# Altium project OpenRex_V1I1.PrjPcb (part 10 of 13)

## Sheet [22] - SD CARD, SPI, FLASH, EEPROM,.SchDoc
size A2; DocumentNumber: 22; SheetNumber: 22; SheetTotal: 31
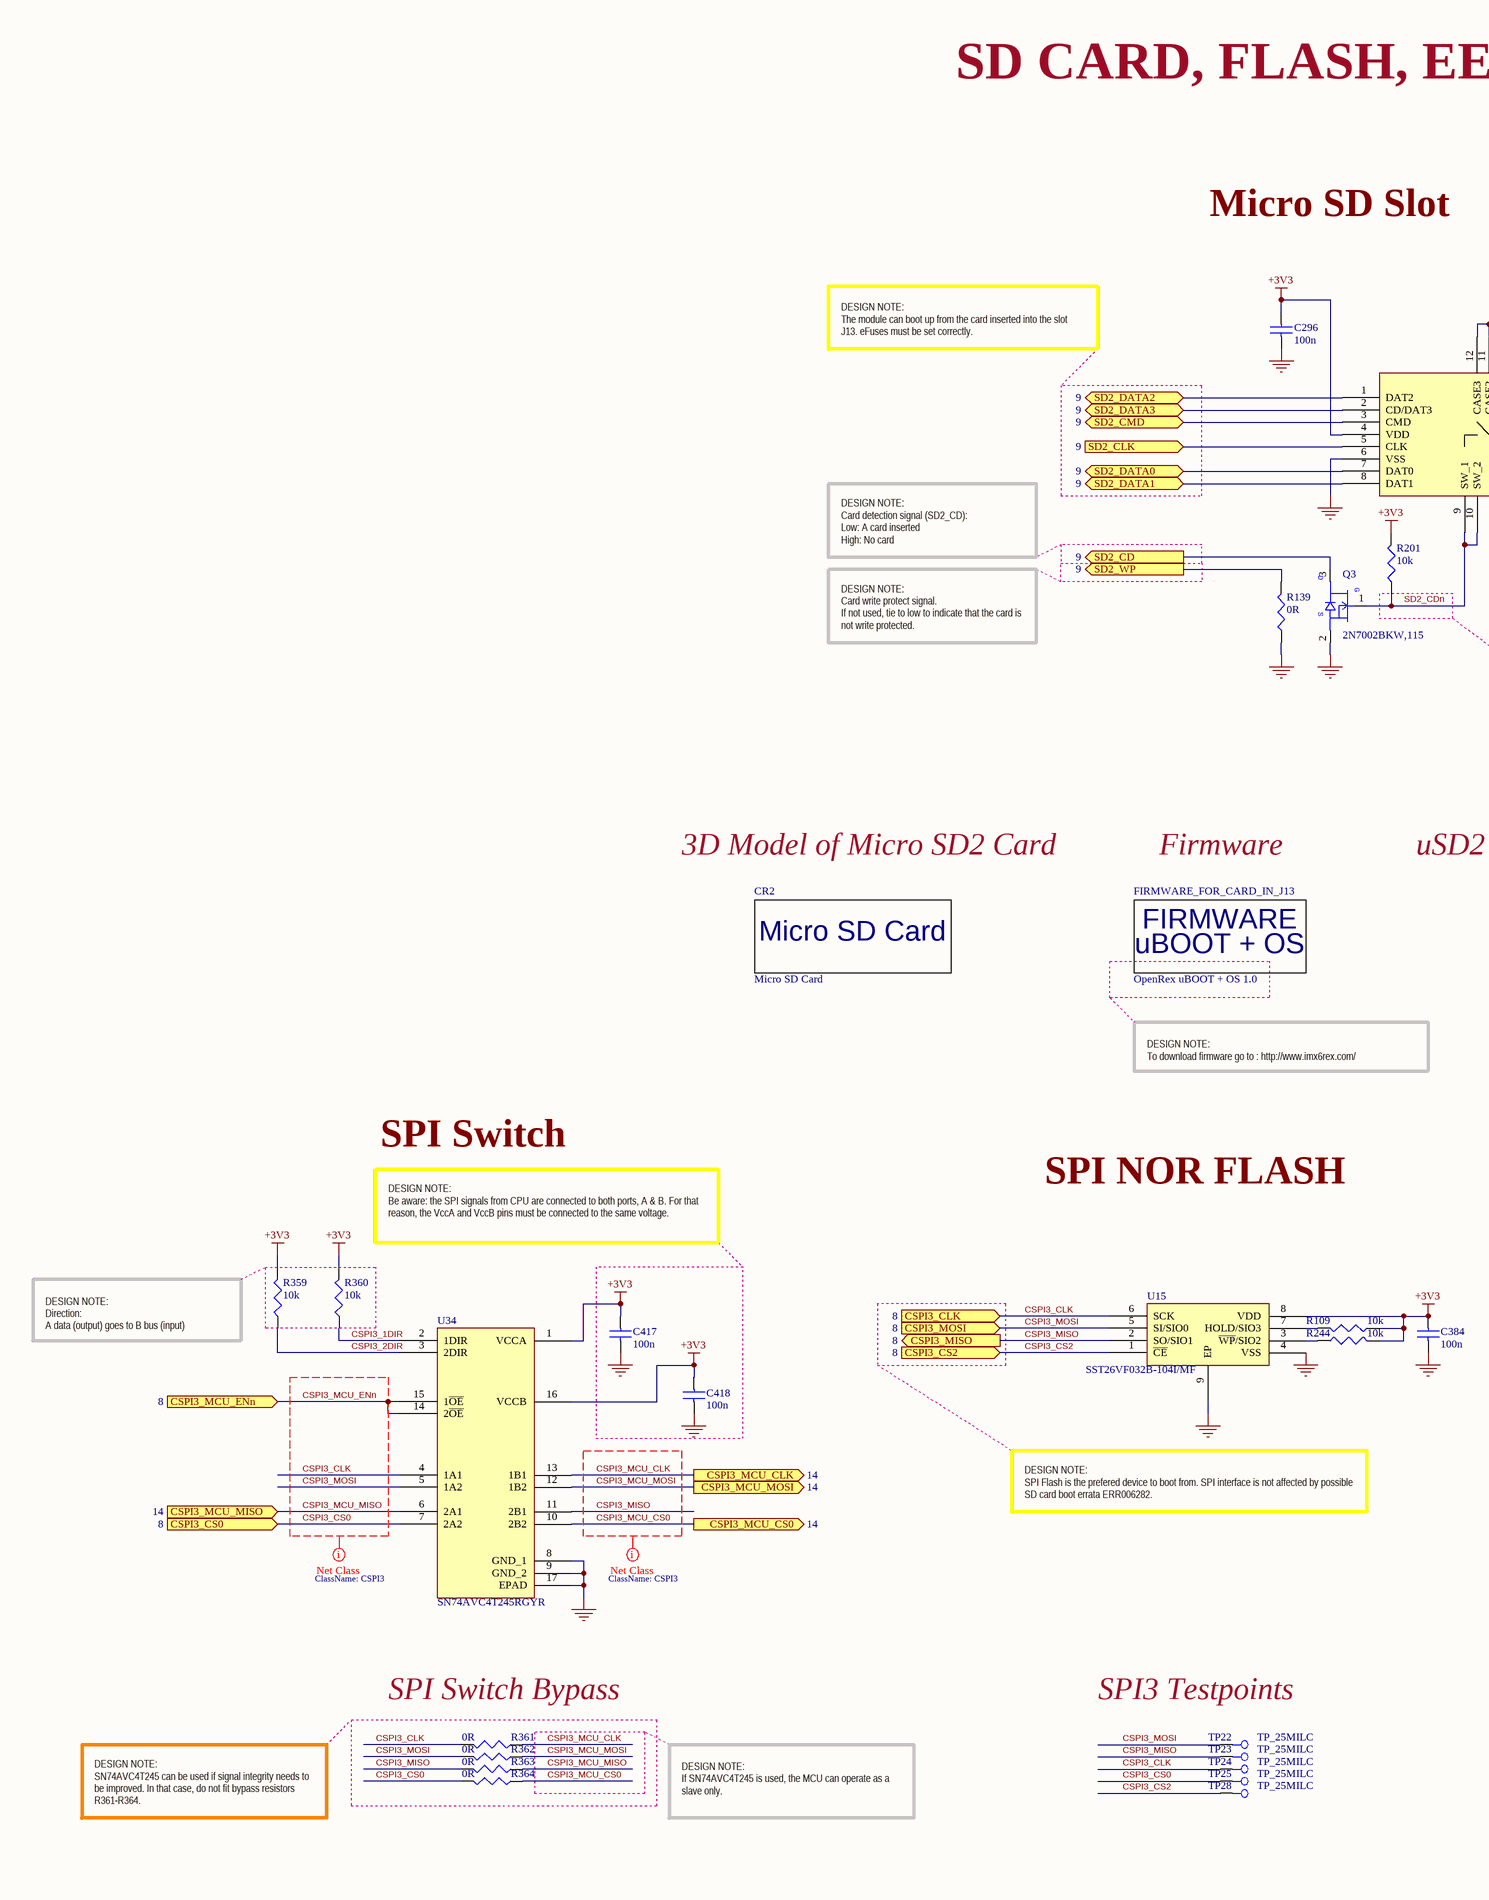
[diagram p40: [22] - SD CARD, SPI, FLASH, EEPROM,.SchDoc, left]
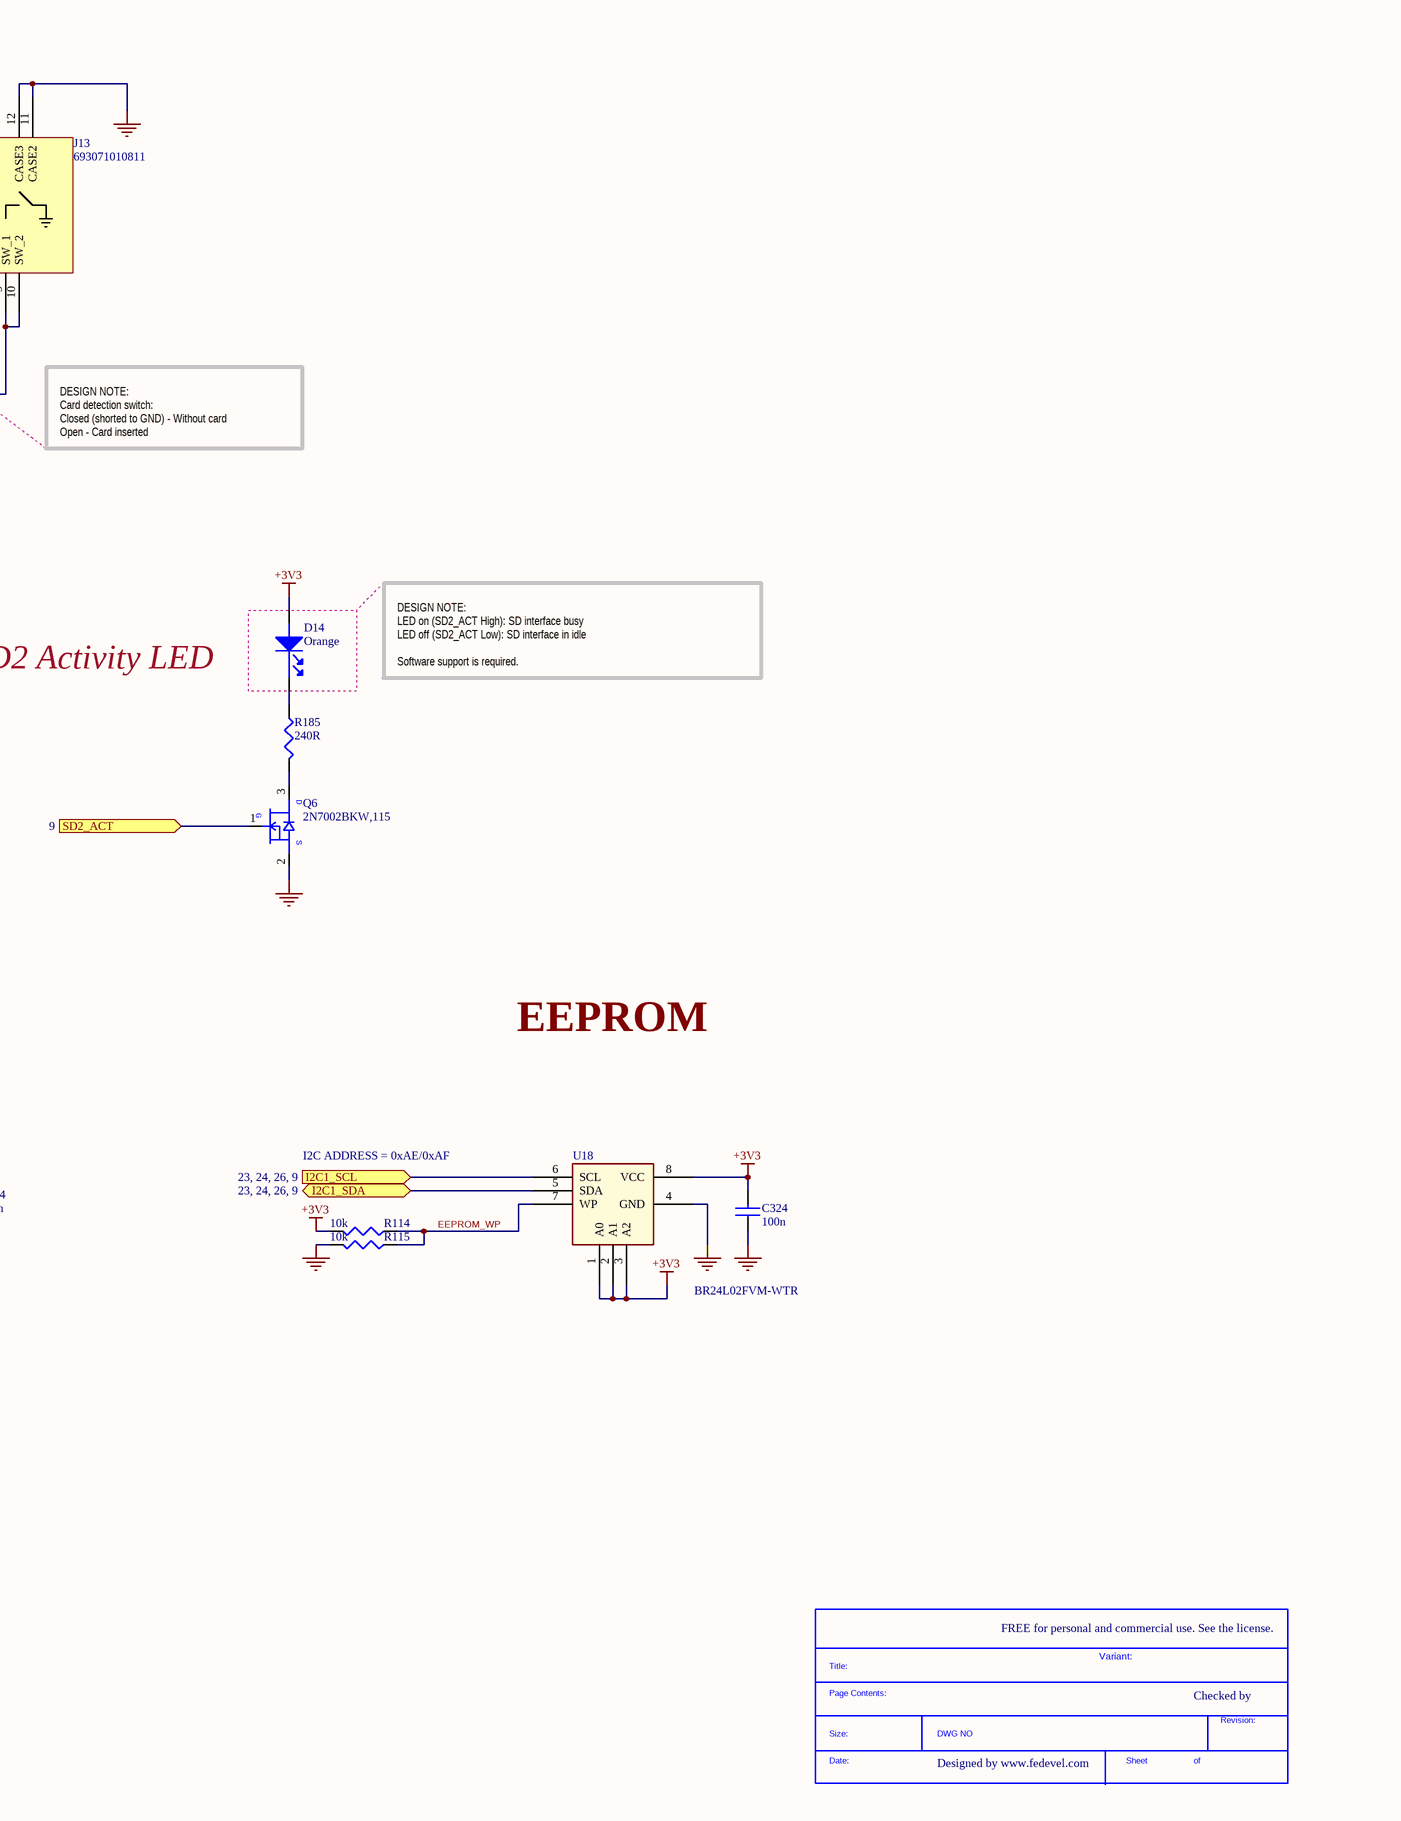
[diagram p41: [22] - SD CARD, SPI, FLASH, EEPROM,.SchDoc, right]

### Parts
(Parts that share a designator on the sheet are numbered #1, #2 ... from top to bottom, then left to right.)
*#24  SDTitleBlock  (value not drawn)  (graphical)
C296  100n  [C0402]
C324  100n  [C0402]
C384  100n  [C0402]
C417  100n  [C0402]
C418  100n  [C0402]
CR2  Micro SD Card  [Micro_SD_card]  (no BOM)
D14  Orange  [LED_0603]
FIRMWARE_FOR_CARD_IN_J13  OpenRex uBOOT + OS 1.0  (mechanical)
J13  693071010811  [693071010811]
Q3  2N7002BKW,115  [SC70_SOT323]
Q6  2N7002BKW,115  [SC70_SOT323]
R109  10k  [R0402]
R114  10k  [R0402]
R115  10k  [R0402]
R139  0R  [R0402]
R185  240R  [R0402]
R201  10k  [R0402]
R244  10k  [R0402]
R359  10k  [R0402]
R360  10k  [R0402]
R361  0R  [R0402]
R362  0R  [R0402]
R363  0R  [R0402]
R364  0R  [R0402]
TP22  TP_25MILC  [TP_25C]  (no BOM)
TP23  TP_25MILC  [TP_25C]  (no BOM)
TP24  TP_25MILC  [TP_25C]  (no BOM)
TP25  TP_25MILC  [TP_25C]  (no BOM)
TP28  TP_25MILC  [TP_25C]  (no BOM)
U15  SST26VF032B-104I/MF  [WSON8_6X5MM]
U18  BR24L02FVM-WTR  [MSOP8 _SMALLER]
U34  SN74AVC4T245RGYR  [RGY (R-PVQFN-N16)]

### Blocks framed on the sheet
SPI Switch Bypass: R361-R364

### Ports
CSPI3_CLK (see 8), CSPI3_CS0 (in, see 8), CSPI3_CS2 (in, see 8), CSPI3_MCU_CLK (out, see 14), CSPI3_MCU_CS0 (out, see 14), CSPI3_MCU_ENn (in, see 8), CSPI3_MCU_MISO (in, see 14), CSPI3_MCU_MOSI (out, see 14), CSPI3_MISO (out, see 8), CSPI3_MOSI (see 8), I2C1_SCL (see 23, 24, 26, 9), I2C1_SDA (bidir, see 23, 24, 26, 9), SD2_ACT (in, see 9), SD2_CD (out, see 9), SD2_CLK (in, see 9), SD2_CMD (bidir, see 9), SD2_DATA0 (bidir, see 9), SD2_DATA1 (bidir, see 9), SD2_DATA2 (bidir, see 9), SD2_DATA3 (bidir, see 9), SD2_WP (out, see 9)

### Nets
+3V3: C296.1 C324.2 C384.1 C417.1 C418.1 D14.2(ANODE) J13.4(VDD) R109.1 R114.2 R201.2 R244.2 R359.2 R360.2 U15.8(VDD) U18.1(A0) U18.2(A1) U18.3(A2) U18.8(VCC) U34.1(VCCA) U34.16(VCCB)
GND: C296.2 C324.1 C384.2 C417.2 C418.2 J13.6(VSS) J13.11(CASE2) J13.12(CASE3) Q3.2(SOURCE) Q6.2(SOURCE) R115.2 R139.1 U15.4(VSS) U15.9(EP) U18.4(GND) U34.8(GND_1) U34.9(GND_2) U34.17(EPAD)
CSPI3_1DIR: R360.1 U34.2(1DIR)
CSPI3_2DIR: R359.1 U34.3(2DIR)
CSPI3_CLK: R361.2 TP24.1 U15.6(SCK) U34.4(1A1) ; port CSPI3_CLK
CSPI3_CS0: R364.2 TP25.1 U34.7(2A2) ; port CSPI3_CS0
CSPI3_CS2: TP28.1 U15.1(~{CE}) ; port CSPI3_CS2
CSPI3_MCU_CLK: R361.1 U34.13(1B1) ; port CSPI3_MCU_CLK
CSPI3_MCU_CS0: R364.1 U34.10(2B2) ; port CSPI3_MCU_CS0
CSPI3_MCU_ENn: U34.14(2~{OE}) U34.15(1~{OE}) ; port CSPI3_MCU_ENn
CSPI3_MCU_MISO: R363.1 U34.6(2A1) ; port CSPI3_MCU_MISO
CSPI3_MCU_MOSI: R362.1 U34.12(1B2) ; port CSPI3_MCU_MOSI
CSPI3_MISO: R363.2 TP23.1 U15.2(SO/SIO1) U34.11(2B1) ; port CSPI3_MISO
CSPI3_MOSI: R362.2 TP22.1 U15.5(SI/SIO0) U34.5(1A2) ; port CSPI3_MOSI
EEPROM_WP: R114.1 R115.1 U18.7(WP)
I2C1_SCL: U18.6(SCL) ; port I2C1_SCL
I2C1_SDA: U18.5(SDA) ; port I2C1_SDA
SD2_ACT: Q6.1(GATE) ; port SD2_ACT
SD2_CD: Q3.3(DRAIN) ; port SD2_CD
SD2_CDn: J13.9(SW_1) J13.10(SW_2) Q3.1(GATE) R201.1
SD2_CLK: J13.5(CLK) ; port SD2_CLK
SD2_CMD: J13.3(CMD) ; port SD2_CMD
SD2_DATA0: J13.7(DAT0) ; port SD2_DATA0
SD2_DATA1: J13.8(DAT1) ; port SD2_DATA1
SD2_DATA2: J13.1(DAT2) ; port SD2_DATA2
SD2_DATA3: J13.2(CD/DAT3) ; port SD2_DATA3
SD2_WP: R139.2 ; port SD2_WP
NetD14_1: D14.1(cathode) R185.1
NetQ6_3: Q6.3(DRAIN) R185.2
NetR109_2: R109.2 U15.7(HOLD/SIO3)
NetR244_1: R244.1 U15.3(~{WP}/SIO2)

### Layout directives
net class CSPI3: CSPI3_CLK, CSPI3_CS0, CSPI3_MCU_CLK, CSPI3_MCU_CS0, CSPI3_MCU_ENn, CSPI3_MCU_MISO, CSPI3_MCU_MOSI, CSPI3_MISO, CSPI3_MOSI

### Notes on the sheet
- SD CARD, FLASH, EEPROM
- Micro SD Slot
- DESIGN NOTE:
  The module can boot up from the card inserted into the slot J13. eFuses must be set correctly.
- DESIGN NOTE:
  Card detection signal (SD2_CD):
  Low: A card inserted
  High: No card
- DESIGN NOTE:
  Card write protect signal.
  If not used, tie to low to indicate that the card is not write protected.
- DESIGN NOTE:
  Card detection switch:
  Closed (shorted to GND) - Without card
  Open - Card inserted
- 3D Model of Micro SD2 Card
- Firmware
- uSD2 Activity LED
- DESIGN NOTE:
  LED on (SD2_ACT High): SD interface busy
  LED off (SD2_ACT Low): SD interface in idle
  Software support is required.
- DESIGN NOTE:
  To download firmware go to : http://www.imx6rex.com/
- SPI Switch
- SPI NOR FLASH
- EEPROM
- DESIGN NOTE:
  Be aware: the SPI signals from CPU are connected to both ports, A & B. For that reason, the VccA and VccB pins must be connected to the same voltage.
- I2C ADDRESS = 0xAE/0xAF
- DESIGN NOTE:
  Direction:
  A data (output) goes to B bus (input)
- DESIGN NOTE:
  SPI Flash is the prefered device to boot from. SPI interface is not affected by possible SD card boot errata ERR006282.
- SPI3 Testpoints
- FREE for personal and commercial use. See the license.
- Variant:
- Checked by
- DESIGN NOTE:
  SN74AVC4T245 can be used if signal integrity needs to be improved. In that case, do not fit bypass resistors R361-R364.
- DESIGN NOTE:
  If SN74AVC4T245 is used, the MCU can operate as a slave only.
- Designed by www.fedevel.com
- (in symbol 2N7002BKW,115) D; G; S
- (in symbol FIRMWARE_OpenRex_uBOOT_OS 1.0) FIRMWARE; uBOOT + OS
- (in symbol SDTitleBlock) Title:; Page Contents:; Revision:; Size:; DWG NO; Date:; Sheet; of

### Library data of the parts
C296 C324 C384 C417 C418 = C1005X5R1H104K: as C307 on sheet [25] - LEDS, BUTTONS; Category: Capacitors; Supplier Part Number: 445-5942-1-ND; Manufacturer Part Number: C1005X5R1H104K; Operating Temperature: -55°C ~ 85°C; Package / Case: 0402 (1005 Metric); Price 1k [$]: 0.02340; .Checked SCH: used; Voltage - Rated: 50V; Supplier: Digikey; Supplier 1: Digi-Key; Supplier Part Number 1: 445-5942-1-ND; RoHS: RoHS Compliant; Stock 1: 106926; Pricing 1: 1=0.27, 10=0.18, 100=0.072, 250=0.05176, 500=0.0369, 1000=0.027 (USD); Tolerance: ±10%; Temperature Coefficient: X5R; Mounting Type: Surface Mount, MLCC; Applications: General Purpose; Ratings: -; Size / Dimension: 0.039" L x 0.020" W (1.00mm x 0.50mm); Height - Seated (Max): -; Thickness (Max): 0.022" (0.55mm); Lead Spacing: -; Features: -; Packaging: Cut Tape (CT); Lead Style: -; ComponentLink1URL: http://www.tdk.co.jp/tefe02/e412_c.pdf; ComponentLink1Description: http://www.tdk.co.jp/tefe02/e412_c.pdf
CR2 = Card_Micro_SD: Card Micro SD; .Creator: MM; Category: Card
D14 = LO L29K-H2K1-24-Z: as D21 on sheet [25] - LEDS, BUTTONS; Supplier 1: Digi-Key; Supplier Part Number 1: 475-2740-1-ND; Manufacturer Part Number: LO L29K-H2K1-24-Z; RoHS: RoHS Compliant; Category: Optoelectronics; Stock 1: 15900; Pricing 1: 1=0.17, 10=0.141, 100=0.1127, 250=0.0986, 500=0.09016 (USD); Color: Orange; Wavelength - Dominant: 606nm; Package / Case: 0603 (1608 Metric); Size / Dimension: 1.70mm L x 0.80mm W; Height: 0.65mm; Mounting Type: Surface Mount; Packaging: Cut Tape (CT); ComponentLink1URL: http://catalog.osram-os.com/catalogue/catalogue.do;jsessionid=302CF83AF637AE24E40AEB0ADA267EDD?act=downloadFile&favOid=020000010003f9de000100b6; ComponentLink1Description: http://catalog.osram-os.com/catalogue/catalogue.do;jsessionid=302CF83AF637AE24E40AEB0ADA267EDD?act=downloadFile&favOid=020000010003f9de000100b6; .Checked SCH: used
FIRMWARE_FOR_CARD_IN_J13 = FIRMWARE_OpenRex_uBOOT_OS 1.0: .Creator: MM; Category: Firmware; .Checked SCH: MM
J13 = 693071010811: CONN MICRO SD 8 POS SMD; Manufacturer: Wurth Electronics Inc; Card Type: Secure Digital - microSD™; Number of Positions: 9 (8 + 1); Connector Type: Connector and Ejector; Insertion, Removal Method: Push In, Push Out; .Creator: MM; .Checked PCB: used; Supplier 1: Digi-Key; Manufacturer Part Number: 693071010811; RoHS: RoHS Compliant; Category: Connectors, Interconnects; Stock 1: 4877; Pricing 1: 1=3.32, 10=3.188, 50=2.805, 100=2.6775, 500=2.295, 1400=2.10375 (USD); Packaging: Cut Tape (CT); Ejector Side: -; Mounting Type: Surface Mount, Right Angle; Features: Switch; Height Above Board: 0.072" (1.83mm); Mounting Feature: Normal, Standard - Top; Contact Finish: Gold; Contact Finish Thickness: -; ComponentLink1URL: http://katalog.we-online.de/em/datasheet/693071010811.pdf; ComponentLink1Description: http://katalog.we-online.de/em/datasheet/693071010811.pdf; Supplier Part Number 1: 732-3819-1-ND; .Checked SCH: used
Q3 Q6 = 2N7002BKW,115: as Q4 on sheet [25] - LEDS, BUTTONS; Supplier 1: Digi-Key; Supplier Part Number 1: 568-5980-1-ND; Manufacturer Part Number: 2N7002BKW,115; RoHS: RoHS Compliant; Category: Discrete Semiconductor Products; Stock 1: 15666; Pricing 1: 1=0.39, 10=0.354, 25=0.2548, 100=0.1983, 250=0.12456, 500=0.10616, 1000=0.07233 (USD); Drain to Source Voltage (Vdss): 60V; Current - Continuous Drain (Id) @ 25° C: 310mA; Mounting Type: Surface Mount; Package / Case: SC-70, SOT-323; Supplier Device Package: SC-70; Packaging: Cut Tape (CT); ComponentLink1URL: http://www.nxp.com/documents/data_sheet/2N7002BKW.pdf; ComponentLink1Description: http://www.nxp.com/documents/data_sheet/2N7002BKW.pdf; .Checked SCH: used
R109 R114 R115 R201 R244 R359 R360 = RC0402FR-0710KL: as R140 on sheet [25] - LEDS, BUTTONS; Category: Resistors; Manufacturer Part Number: RC0402FR-0710KL; Package / Case: 0402 (1005 Metric); Price 1k [$]: 0.01421; Resistance (Ohms): 10K; Tolerance: ±1%; Value: 10k; .Checked SCH: used; Supplier Part Number: 311-10.0KLRCT-ND; Supplier: Digikey; Supplier 1: Digi-Key; Supplier Part Number 1: 311-10.0KLRCT-ND; RoHS: RoHS Compliant; Stock 1: 2916495; Pricing 1: 10=0.014, 50=0.0104, 100=0.0079, 250=0.00584, 500=0.00432, 1000=0.00288 (USD); Composition: Thick Film; Features: -; Size / Dimension: 0.039" L x 0.020" W (1.00mm x 0.50mm); Height: 0.016" (0.40mm); Number of Terminations: 2; Packaging: Cut Tape (CT); ComponentLink1URL: http://www.yageo.com/documents/recent/PYu-RC0402_51_RoHS_L_6.pdf; ComponentLink1Description: http://www.yageo.com/documents/recent/PYu-RC0402_51_RoHS_L_6.pdf
R139 R361-R364 = RC0402JR-070RL: as R348 on sheet [25] - LEDS, BUTTONS; Category: Resistors; Supplier Part Number: 311-0.0JRCT-ND; Manufacturer Part Number: RC0402JR-070RL; Package / Case: 0402 (1005 Metric); Price 1k [$]: 0.01389; Value: 0R; .Checked SCH: used; Supplier: Digikey; Supplier 1: Digi-Key; Supplier Part Number 1: 311-0.0JRCT-ND; RoHS: RoHS Compliant; Stock 1: 1106330; Pricing 1: 10=0.012, 50=0.009, 100=0.0069, 250=0.00512, 500=0.0038, 1000=0.00253 (USD); Composition: Thick Film; Features: -; Temperature Coefficient: -; Size / Dimension: 0.039" L x 0.020" W (1.00mm x 0.50mm); Height: 0.016" (0.40mm); Number of Terminations: 2; Packaging: Cut Tape (CT); ComponentLink1URL: http://www.yageo.com/documents/recent/PYu-RC0402_51_RoHS_L_6.pdf; ComponentLink1Description: http://www.yageo.com/documents/recent/PYu-RC0402_51_RoHS_L_6.pdf
R185 = RMCF0402FT240R: as R146 on sheet [25] - LEDS, BUTTONS; Category: Resistors; Supplier Part Number: RMCF0402FT240RCT-ND; Manufacturer Part Number: RMCF0402FT240R; Package / Case: 0402 (1005 Metric); Price 1k [$]: 0.00384; Tolerance: ±1%; Value: 240R; .Checked SCH: used; Supplier: Digikey; Supplier 1: Digi-Key; Supplier Part Number 1: RMCF0402FT240RCT-ND; RoHS: RoHS Compliant; Stock 1: 39860; Pricing 1: 1=0.04, 10=0.025, 50=0.0138, 100=0.0105, 250=0.0078, 500=0.00576, 1000=0.00384 (USD); Composition: Thick Film; Features: -; Size / Dimension: 0.039" L x 0.020" W (1.00mm x 0.50mm); Height: 0.016" (0.40mm); Number of Terminations: 2; Packaging: Cut Tape (CT); ComponentLink1URL: http://www.seielect.com/Catalog/SEI-RMCF.pdf; ComponentLink1Description: http://www.seielect.com/Catalog/SEI-RMCF.pdf
TP22-TP25 TP28 = TP_25MILC: Test Point 25mil
U15 = SST26VF032B-104I/MF: IC FLASH 32MBIT; Manufacturer: Microchip Technology; Memory Size: 32M (4M x 8); Speed: 104MHz; Interface: SQI, SPI; Voltage - Supply: 2.7 V ~ 3.6 V; .Creator: MM; .Checked PCB: MM, paper model not chceked; Supplier 1: Digi-Key; Manufacturer Part Number: SST26VF032B-104I/MF; RoHS: RoHS Compliant; Category: Integrated Circuits (ICs); Stock 1: 417; Pricing 1: 1=1.68, 25=1.62, 100=1.56 (USD); Packaging: Tube; Format - Memory: FLASH; Memory Type: FLASH; Operating Temperature: -40°C ~ 85°C; Package / Case: 8-WDFN Exposed Pad; Supplier Device Package: 8-WDFN (5x6); ComponentLink1URL: http://www.microchip.com/mymicrochip/filehandler.aspx?ddocname=en566514; ComponentLink1Description: http://www.microchip.com/mymicrochip/filehandler.aspx?ddocname=en566514; Supplier Part Number 1: SST26VF032B-104I/MF-ND; .Checked SCH: MM
U18 = BR24L02FVM-WTR: IC EEPROM 2KBIT 400KHZ 8MSOP; Manufacturer: Rohm Semiconductor; Format - Memory: EEPROMs - Serial; Memory Size: 2K (256 x 8); Interface: I²C, 2-Wire Serial; Voltage - Supply: 1.8 V ~ 5.5 V; .Checked PCB: used; Supplier 1: Digi-Key; Supplier Part Number 1: BR24L02FVM-WCT-ND; Manufacturer Part Number: BR24L02FVM-WTR; RoHS: RoHS Compliant; Category: Integrated Circuits (ICs); Stock 1: 19923; Pricing 1: 1=0.78, 25=0.602, 100=0.531, 250=0.4602, 500=0.3894, 1000=0.30975 (USD); Memory Type: EEPROM; Speed: 400kHz; Operating Temperature: -40°C ~ 85°C; Package / Case: 8-VSSOP, 8-MSOP (0.110", 2.80mm Width); Supplier Device Package: 8-MSOP; Packaging: Cut Tape (CT); ComponentLink1URL: http://www.rohm.com/products/databook/eeprom/pdf/br24l-e.pdf; ComponentLink1Description: http://www.rohm.com/products/databook/eeprom/pdf/br24l-e.pdf; .Checked SCH: used
U34 = SN74AVC4T245RGYR: IC BUS TRANSCVR 4BIT 16QFN; Manufacturer: Texas Instruments; Logic Function: Translator, Bidirectional, 3-State; Input Type: Voltage; Data Rate: 380Mbps; Number of Channels: 2; Differential - Input:Output: No/No; Propagation Delay (Max): 2.9ns; Voltage - Supply: 1.2 V ~ 3.6 V; .Creator: MM; Supplier 1: Digi-Key; Manufacturer Part Number: SN74AVC4T245RGYR; RoHS: RoHS Compliant; Category: Integrated Circuits (ICs); Stock 1: 17293; Pricing 1: 1=1.15, 10=0.924, 100=0.71, 500=0.548, 1000=0.495 (USD); Packaging: Cut Tape (CT); Output Type: Voltage; Number of Outputs/Channel: 2; Operating Temperature: -40°C ~ 85°C; Package / Case: 16-VFQFN Exposed Pad; Supplier Device Package: 16-VQFN (4x4); Mounting Type: Surface Mount; ComponentLink1URL: http://www.ti.com/lit/ds/symlink/sn74avc4t245.pdf; ComponentLink1Description: http://www.ti.com/lit/ds/symlink/sn74avc4t245.pdf; Supplier Part Number 1: 296-18231-1-ND; .Checked PCB: MM; .Checked SCH: MM